# Altium schematic sheet USB_Serial.SchDoc
size A3; Organization: Altium Limited; Address1: L3, 12a Rodborough Rd; Address2: Frenchs Forest; Address3: NSW; Address4: Australia 2086; DocumentNumber: 8; SheetNumber: 8; SheetTotal: 8
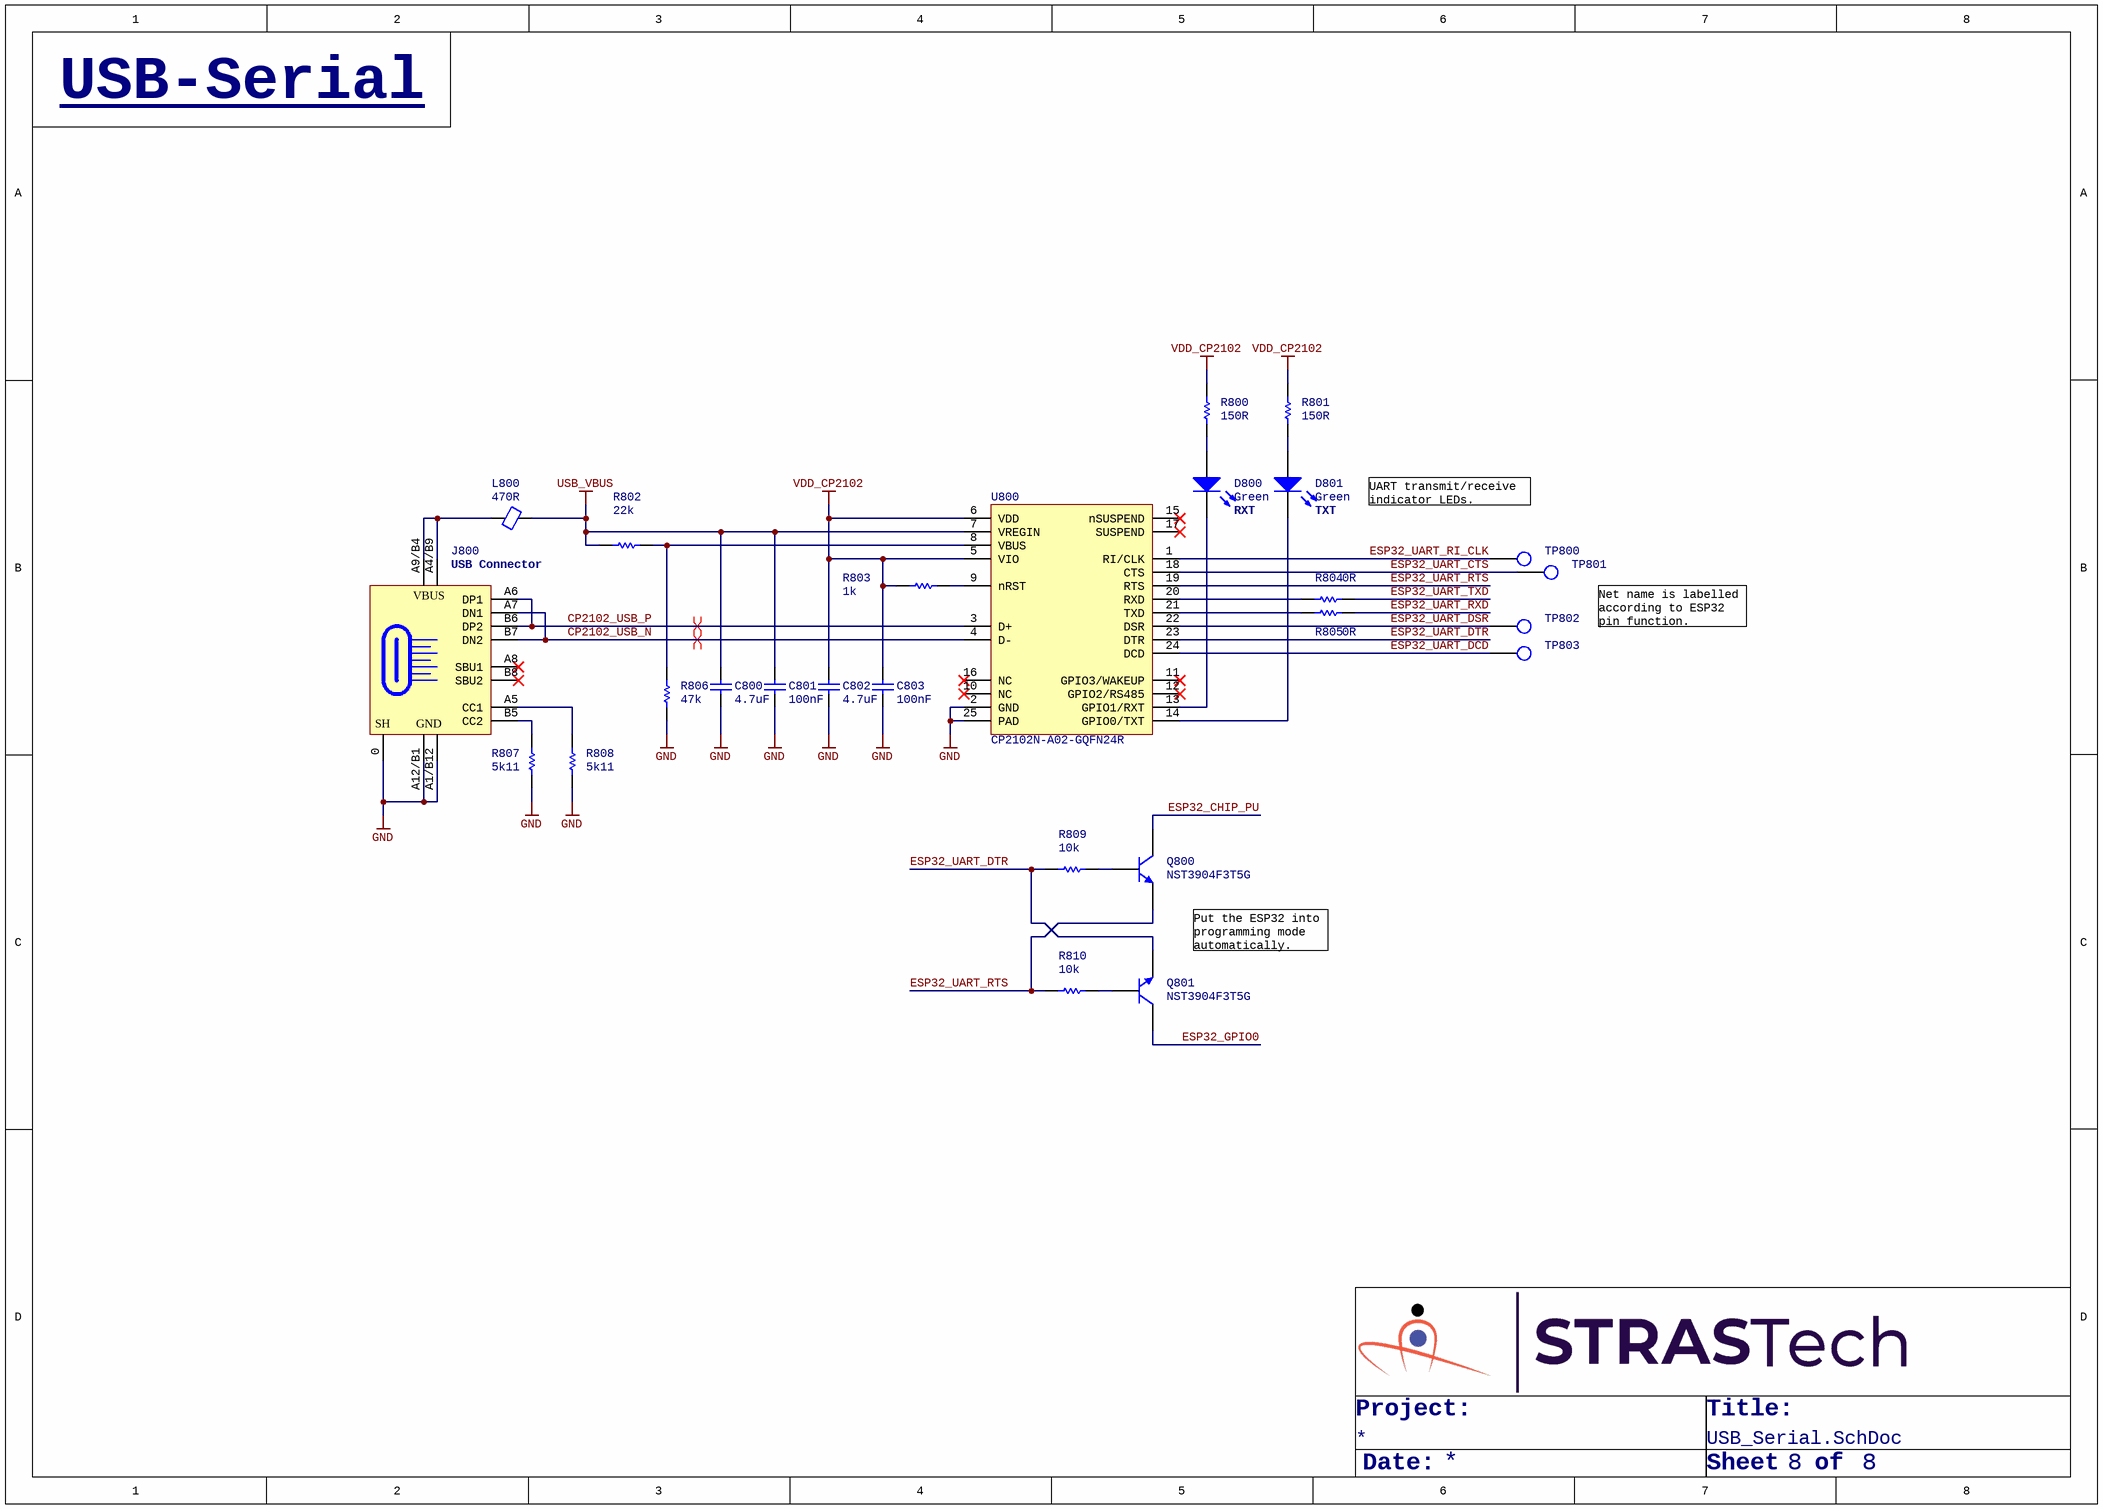
[diagram p0: USB_Serial.SchDoc]

## Parts
C800  4.7uF  [Cap,SMD,0402]
C801  100nF  [Cap,SMD,0402]
C802  4.7uF  [Cap,SMD,0402]
C803  100nF  [Cap,SMD,0402]
D800  Green  [LED,0603]
D801  Green  [LED,0603]
J800  USB  [CONN,USB_C,SMD]  (value not drawn)
L800  470R  [IND,0402]
Q800  NST3904F3T5G  [SOT1123]
Q801  NST3904F3T5G  [SOT1123]
R800  150R  [RES,0402]
R801  150R  [RES,0402]
R802  22k  [RES,0402]
R803  1k  [RES,0402]
R804  0R  [RES,0402]
R805  0R  [RES,0402]
R806  47k  [RES,0402]
R807  5k11  [RES,0402]
R808  5k11  [RES,0402]
R809  10k  [RES,0402]
R810  10k  [RES,0402]
TP800  TESTPOINT  [testpoint,smd,round,1mm]  (value not drawn)
TP801  TESTPOINT  [testpoint,smd,round,1mm]  (value not drawn)
TP802  TESTPOINT  [testpoint,smd,round,1mm]  (value not drawn)
TP803  TESTPOINT  [testpoint,smd,round,1mm]  (value not drawn)
U800  CP2102N-A02-GQFN24R  [IC,VQFN-24,THERMAL,4x4]

## Nets
GND: C800.1 C801.1 C802.1 C803.1 J800.0(SHIELD) J800.A1/B12(GND) J800.A12/B1(GND) R806.1 R807.1 R808.1 U800.2(GND) U800.25(PAD)
USB_VBUS: C800.2 C801.2 L800.2 R802.1 U800.7(VREGIN)
VDD_CP2102: C802.2 C803.2 R800.2 R801.2 R803.2 U800.5(VIO) U800.6(VDD)
CP2102_USB_N: J800.A7(DN1) J800.B7(DN2) U800.4(D-)
CP2102_USB_P: J800.A6(DP1) J800.B6(DP2) U800.3(D+)
ESP32_CHIP_PU: Q800.3(C)
ESP32_GPIO0: Q801.3(C)
ESP32_UART_CTS: TP801.1(TP) U800.18(CTS)
ESP32_UART_DCD: TP803.1(TP) U800.24(DCD)
ESP32_UART_DSR: TP802.1(TP) U800.22(DSR)
ESP32_UART_DTR: Q801.2(E) R809.2 U800.23(DTR)
ESP32_UART_RI_CLK: TP800.1(TP) U800.1(RI/CLK)
ESP32_UART_RTS: Q800.2(E) R810.2 U800.19(RTS)
ESP32_UART_RXD: R805.2
ESP32_UART_TXD: R804.2
NetD800_1: D800.1(A) R800.1
NetD800_2: D800.2(K) U800.13(GPIO1/RXT)
NetD801_1: D801.1(A) R801.1
NetD801_2: D801.2(K) U800.14(GPIO0/TXT)
NetJ800_A4/B9: J800.A4/B9(VBUS) J800.A9/B4(VBUS) L800.1
NetJ800_A5: J800.A5(CC1) R808.2
NetJ800_B5: J800.B5(CC2) R807.2
NetQ800_1: Q800.1(B) R809.1
NetQ801_1: Q801.1(B) R810.1
NetR802_2: R802.2 R806.2 U800.8(VBUS)
NetR803_1: R803.1 U800.9(nRST)
NetR804_1: R804.1 U800.20(RXD)
NetR805_1: R805.1 U800.21(TXD)

Not connected (* = marked no-connect by the designer): J800 A8(SBU1)* B8(SBU2)*; U800 10(NC)* 11(GPIO3/WAKEUP)* 12(GPIO2/RS485)* 15(nSUSPEND)* 16(NC)* 17(SUSPEND)*

## Layout directives
differential pair: CP2102_USB_N, CP2102_USB_P

## Notes on the sheet
- USB-Serial
- RXT
- (near D801) TXT
- UART transmit/receive indicator LEDs.
- (near J800) USB Connector
- Net name is labelled according to ESP32 pin function.
- Put the ESP32 into programming mode automatically.
- Project:
- Title:
- Date:
- Sheet
- of
- Title
- Size:
- A3
- Revision:
- Design By:
- (in symbol Conn,USB_C,SMD) SH

## Library data of the parts
C800 C802 = CAP,Cer,4.7uF,16VDC,X5R,0402: 4.7 µF ±20% 16V Ceramic Capacitor X5R 0402 (1005 Metric); Vendor Part Number: 478-10788-1-ND; Manufacturer: AVX Corporation; Manufacturer Part Number: 0402YD475MAT2A; Vendor: Digikey; HelpURL: https://datasheets.avx.com/cx5r.pdf; CreatedBy: Judd Foster
C801 C803 = CAP,Cer,100nF,25VDC,X7R,0402: 0.1µF ±10% 25V Ceramic Capacitor X7R 0402 (1005 Metric); Vendor Part Number: 490-14603-1-ND; Manufacturer: Murata Electronics; Manufacturer Part Number: GRM155R71E104KE14J; Vendor: Digikey; HelpURL: https://search.murata.co.jp/Ceramy/image/img/A01X/G101/ENG/GRM155R71E104KE14-01.pdf; CreatedBy: Judd Foster
D800 D801 = LED,Green,SMD,0603: Green 530nm LED Indication - Discrete 3V 0603 (1608 Metric); Manufacturer: Stanley Electric Co; Manufacturer Part Number: THG1111C-0005-TR; Vendor Part Number: 404-1286-1-ND; Vendor: Digikey; CreatedBy: Judd Foster; HelpURL: http://www.stanley-components.com/php/downloaddatafile.php?rp=0,THG1111C-0005_e.pdf
J800 = Conn,USB_C,SMD: USB-C (USB TYPE-C) USB 2.0 Receptacle Connector 24 (16+8 Dummy) Position Surface Mount, Right Angle; Manufacturer: GCT; Manufacturer Part Number: USB4110-GF-A; Vendor Part Number: 2073-USB4110-GF-A-1-ND; Vendor: Digikey; CreatedBy: Judd Foster; HelpURL: https://gct.co/files/drawings/usb4110.pdf
L800 = Ferrite,470R@100MHz,0402: 470 Ohms @ 100 MHz 1 Power Line Ferrite Bead 0402 (1005 Metric) 1A 200mOhm; Vendor Part Number: 490-10662-1-ND; Manufacturer: Murata Electronics; Manufacturer Part Number: BLM15PX471SN1D; Vendor: Digikey; HelpURL: https://www.murata.com/en-us/products/productdata/8796740059166/ENFA0018.pdf; CreatedBy: Judd Foster
Q800 Q801 = Trans,NPN,40V,200mA,SOT1123: Bipolar (BJT) Transistor NPN 40 V 200 mA 200MHz 290 mW Surface Mount SOT-1123; Manufacturer: ON Semiconductor; Vendor Part Number: NST3904F3T5GOSCT-ND; Vendor: Digikey; CreatedBy: Judd Foster; HelpURL: https://www.onsemi.com/pdf/datasheet/nst3904f3-d.pdf; Manufacturer Part Number: NST3904F3T5G
R800 R801 = RES,150R,1%,0.1W,0402: 150 Ohms ±1% 0.063W, 1/16W Chip Resistor 0402 (1005 Metric) Automotive AEC-Q200, Moisture Resistant Thick Film; Manufacturer: TE Connectivity Passive Product; Manufacturer Part Number: CRGCQ0402F150R; Vendor Part Number: A129617CT-ND; Vendor: Digikey; CreatedBy: Judd Foster; HelpURL: https://www.te.com/commerce/DocumentDelivery/DDEController?Action=srchrtrv&DocNm=1773204-3&DocType=DS&DocLang=English
R802 = RES,22k,1%,0.063W,0402: 22 kOhms ±1% 0.063W, 1/16W Chip Resistor 0402 (1005 Metric) Automotive AEC-Q200 Thick Film; Vendor Part Number: RMCF0402FT22K0CT-ND; Manufacturer: Stackpole Electronics Inc; Manufacturer Part Number: RMCF0402FT22K0; Vendor: DIgikey; HelpURL: https://www.seielect.com/catalog/sei-rmcf_rmcp.pdf; CreatedBy: Judd Foster
R803 = RES,1k,5%,0.063W,0402: 1 kOhms ±5% 0.063W, 1/16W Chip Resistor 0402 (1005 Metric) Automotive AEC-Q200 Thick Film; Vendor Part Number: RMCF0402JT1K00CT-ND; Manufacturer: Stackpole Electronics Inc; Manufacturer Part Number: RMCF0402JT1K00; Vendor: DIgikey; HelpURL: https://www.seielect.com/catalog/sei-rmcf_rmcp.pdf; CreatedBy: Judd Foster
R804 R805 = RES,0R0,0.1W,0402: 0 Ohms Jumper 0.1W, 1/10W Chip Resistor 0402 (1005 Metric) Automotive AEC-Q200 Thick Film; Manufacturer: Panasonic Electronic Components; Manufacturer Part Number: ERJ-2GE0R00X; Vendor Part Number: P0.0JCT-ND; Vendor: Digikey; CreatedBy: Judd Foster; HelpURL: https://industrial.panasonic.com/cdbs/www-data/pdf/RDA0000/AOA0000C301.pdf
R806 = RES,47k,1%,0.1W,0402: 47 kOhms ±1% 0.1W, 1/10W Chip Resistor 0402 (1005 Metric) Automotive AEC-Q200 Thick Film; Manufacturer: Panasonic Electronic Components; Manufacturer Part Number: ERJ-2RKF4702X; Vendor Part Number: P47.0KLCT-ND; Vendor: Digikey; CreatedBy: Judd Foster; HelpURL: https://industrial.panasonic.com/cdbs/www-data/pdf/RDA0000/AOA0000C304.pdf
R807 R808 = RES,5k11,1%,0.063W,0402: 5.11 kOhms ±1% 0.063W, 1/16W Chip Resistor 0402 (1005 Metric) Automotive AEC-Q200, Moisture Resistant Thick Film; Manufacturer: Yageo; Manufacturer Part Number: AC0402FR-075K11L; Vendor Part Number: 13-AC0402FR-075K11LCT-ND; Vendor: Digikey; CreatedBy: Judd Foster; HelpURL: https://www.yageo.com/upload/media/product/productsearch/datasheet/rchip/PYu-AC_51_RoHS_L_7.pdf
R809 R810 = RES,10k,5%,0.063W,0402: 10 kOhms ±5% 0.063W, 1/16W Chip Resistor 0402 (1005 Metric) Automotive AEC-Q200 Thick Film; Vendor Part Number: RMCF0402JT10K0CT-ND; Manufacturer: Stackpole Electronics Inc; Manufacturer Part Number: RMCF0402JT10K0; Vendor: DIgikey; HelpURL: https://www.seielect.com/catalog/sei-rmcf_rmcp.pdf; CreatedBy: Judd Foster
TP800-TP803 = TESTPOINT: PCB Testpoint; CreatedBy: Judd Foster; HelpURL: N/A; Manufacturer: N/A; Manufacturer Part Number: N/A; Vendor: N/A; Vendor Part Number: N/A
U800 = CP2102N-A02-GQFN24R: USB Bridge, USB to UART USB 2.0 UART Interface 24-QFN (4x4); Manufacturer: Silicon Labs; Vendor Part Number: 336-5888-1-ND; Vendor: Digikey; CreatedBy: Judd Foster; HelpURL: https://www.silabs.com/documents/public/data-sheets/cp2102n-datasheet.pdf; Manufacturer Part Number: CP2102N-A02-GQFN24R